# Altium schematic sheet Power_SchematicWITHFOOTPRINTS.SchDoc
size A4; SheetNumber: 1; SheetTotal: 1
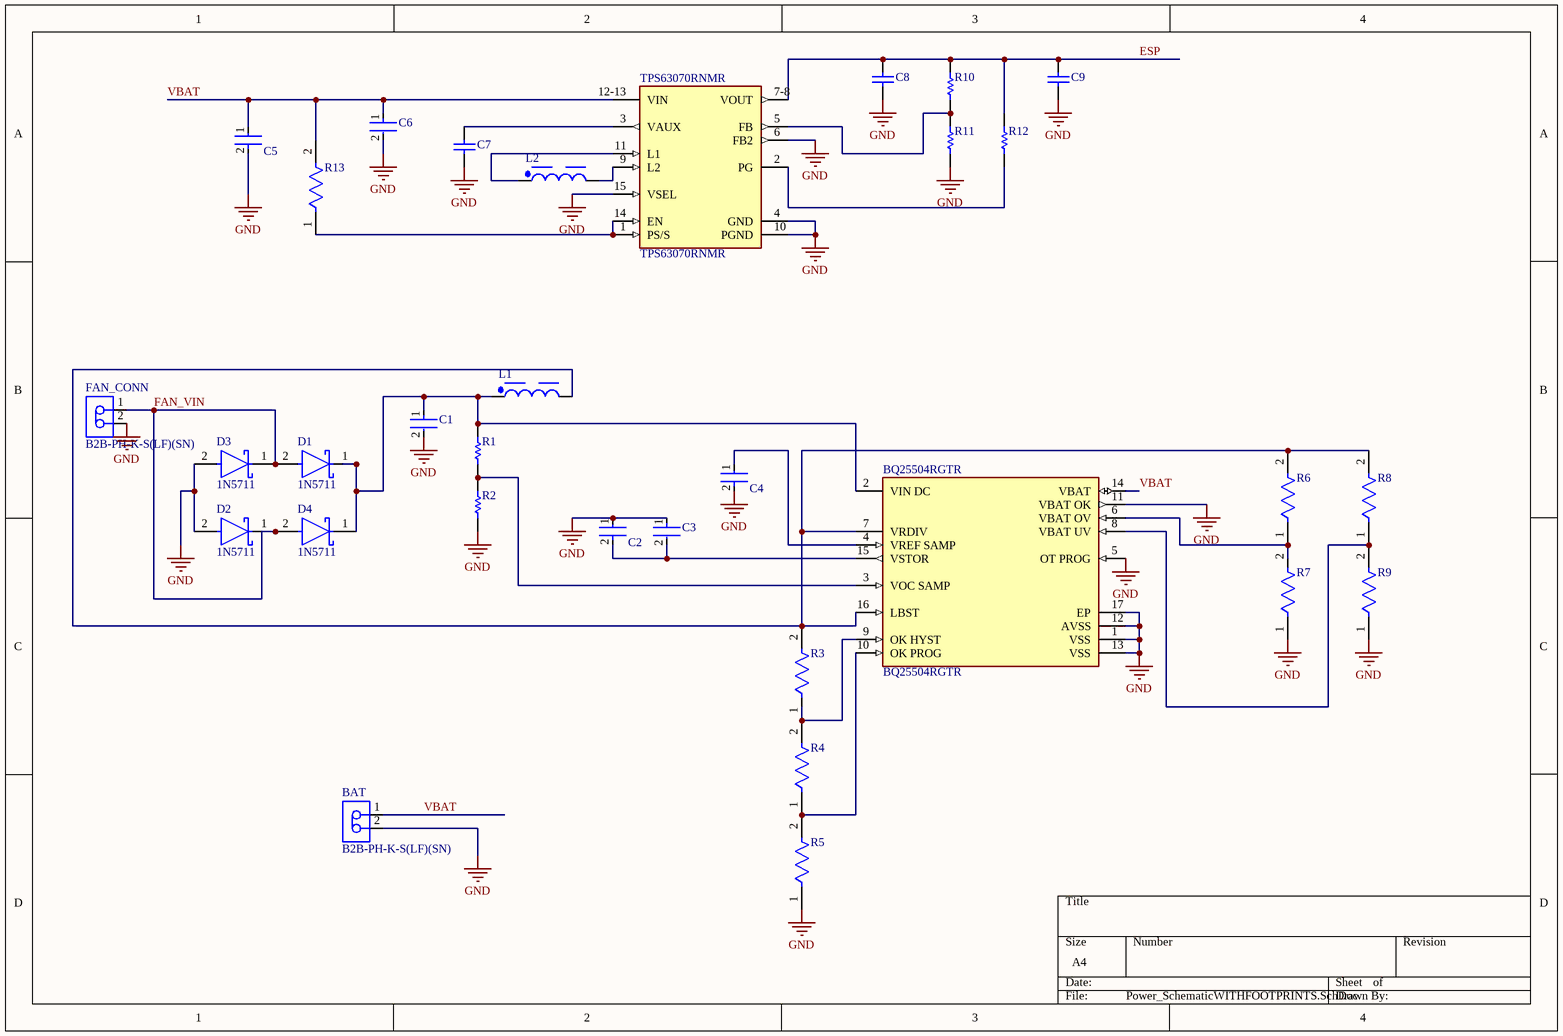
[diagram p0: Power_SchematicWITHFOOTPRINTS.SchDoc]

## Parts
BAT  B2B-PH-K-S(LF)(SN)  [JST-B2B-PH-K-S_V]
BQ25504RGTR  BQ25504RGTR  [FP-RGT0016C-IPC_B]
C1  RCER71E475K2DBH03A  [FP-RCE2A2-MFG]  (value not drawn)
C2  562R5GAS10  [FP-562R5GAS10-MFG]  (value not drawn)
C3  RCER71E475K2DBH03A  [FP-RCE2A2-MFG]  (value not drawn)
C4  562R5GAS10  [FP-562R5GAS10-MFG]  (value not drawn)
C5  562R5GAS10  [FP-562R5GAS10-MFG]  (value not drawn)
C6  RCER71E106K3DBH03A  [FP-RCE3DB-MFG]  (value not drawn)
C7  C320C104K5R5TA  [CAPR51-254-508X318X736]  (value not drawn)
C8  C320C104K5R5TA  [CAPR51-254-508X318X736]  (value not drawn)
C9  C320C104K5R5TA  [CAPR51-254-508X318X736]  (value not drawn)
D1  1N5711  [FP-DO-35-MFG]
D2  1N5711  [FP-DO-35-MFG]
D3  1N5711  [FP-DO-35-MFG]
D4  1N5711  [FP-DO-35-MFG]
FAN_CONN  B2B-PH-K-S(LF)(SN)  [JST-B2B-PH-K-S_V]
L1  7447471033  [WE-TIS_1111]  (value not drawn)
L2  744741221  [WE-TI_8055]  (value not drawn)
R1  PR02000206202JA100  [VISH-A1-2_V2]  (value not drawn)
R2  PR02000206202JA100  [VISH-A1-2_V2]  (value not drawn)
R3  MRS25000C1000FRP00  [FP-MRS25-MFG]  (value not drawn)
R4  MRS25000C1000FRP00  [FP-MRS25-MFG]  (value not drawn)
R5  MRS25000C1000FRP00  [FP-MRS25-MFG]  (value not drawn)
R6  MRS25000C1000FRP00  [FP-MRS25-MFG]  (value not drawn)
R7  MRS25000C1000FRP00  [FP-MRS25-MFG]  (value not drawn)
R8  MRS25000C1000FRP00  [FP-MRS25-MFG]  (value not drawn)
R9  MRS25000C1000FRP00  [FP-MRS25-MFG]  (value not drawn)
R10  PR02000206202JA100  [VISH-A1-2_V2]  (value not drawn)
R11  PR02000206202JA100  [VISH-A1-2_V2]  (value not drawn)
R12  PR02000206202JA100  [VISH-A1-2_V2]  (value not drawn)
R13  MRS25000C1002FCT00  [FP-MRS25-MFG]  (value not drawn)
TPS63070RNMR  TPS63070RNMR  [FP-RNM0015A-MFG]

## Nets
GND: BAT.2 BQ25504RGTR.1(VSS) BQ25504RGTR.5(OT_PROG) BQ25504RGTR.11(VBAT_OK) BQ25504RGTR.12(AVSS) BQ25504RGTR.13(VSS) BQ25504RGTR.17(EP) C1.2 C2.1 C3.1 C4.2 C5.2 C6.2 C7.1 C8.1 C9.1 D2.2(A) D3.2(A) FAN_CONN.2 R2.1 R5.1 R7.1 R9.1 R11.1 TPS63070RNMR.4(GND) TPS63070RNMR.6(FB2) TPS63070RNMR.10(PGND) TPS63070RNMR.15(VSEL)
ESP: C8.2 C9.2 R10.2 R12.2 TPS63070RNMR.7-8(VOUT)
FAN_VIN: D1.2(A) D2.1(C) D3.1(C) D4.2(A) FAN_CONN.1
VBAT: BAT.1 BQ25504RGTR.14(VBAT) C5.1 C6.1 R13.2 TPS63070RNMR.12-13(VIN)
NetBQ25504RGTR_2: BQ25504RGTR.2(VIN_DC) C1.1 D1.1(C) D4.1(C) L1.1 R1.2
NetBQ25504RGTR_3: BQ25504RGTR.3(VOC_SAMP) R1.1 R2.2
NetBQ25504RGTR_4: BQ25504RGTR.4(VREF_SAMP) C4.1
NetBQ25504RGTR_6: BQ25504RGTR.6(VBAT_OV) R6.1 R7.2
NetBQ25504RGTR_7: BQ25504RGTR.7(VRDIV) BQ25504RGTR.16(LBST) L1.2 R3.2 R6.2 R8.2
NetBQ25504RGTR_8: BQ25504RGTR.8(VBAT_UV) R8.1 R9.2
NetBQ25504RGTR_9: BQ25504RGTR.9(OK_HYST) R3.1 R4.2
NetBQ25504RGTR_10: BQ25504RGTR.10(OK_PROG) R4.1 R5.2
NetBQ25504RGTR_15: BQ25504RGTR.15(VSTOR) C2.2 C3.2
NetC7_2: C7.2 TPS63070RNMR.3(VAUX)
NetL2_1: L2.1 TPS63070RNMR.11(L1)
NetL2_2: L2.2 TPS63070RNMR.9(L2)
NetR10_1: R10.1 R11.2 TPS63070RNMR.5(FB)
NetR12_1: R12.1 TPS63070RNMR.2(PG)
NetR13_1: R13.1 TPS63070RNMR.1(PS/S) TPS63070RNMR.14(EN)

## Library data of the parts
BAT FAN_CONN = CMP-2000-05162-1: Male Header, Pitch 2 mm, 1 x 2 Position, Height 6 mm, Tail Length 3.4 mm, -25 to 85 degC, RoHS, Bulk; Manufacturer: JST; Pitch: 2mm; Style/Orientation: StraightHeader/Plug; No of Positions: 2; Datasheet Version: Nov-08; Datasheet URL: http://datasheet.octopart.com/B2B-PH-K-S%28LF%29%28SN%29-JST-datasheet-8324864.pdf; Manufacturer URL: http://www.jst.com/home2.html; Type: ShroudedHeader; Termination: Crimp
BQ25504RGTR = CMP-0321-00248-3: IC ENERGY HARV CTRLR BATT 16QFN; Operating Supply Current: 330nA; Switching Frequency: 1MHz; Max Supply Voltage: 5.25V; Min Supply Voltage: 2.5V; Min Input Voltage: 130mV; Operating Supply Voltage: 3V; Output Current: 200mA; Min Operating Temperature: -40°C; Package Quantity: 3000; REACH SVHC: No SVHC; Case/Package: QFN; Height: 0.9mm; RoHS Compliant: Yes; Max Operating Temperature: 85°C; Number of Pins: 16; Series: BQ25504; Contact Plating: Gold; Lead Free: Lead Free; Packaging: Tape and Reel; Length: 3mm; Radiation Hardening: No
C1 C3 = CMP-06035-022497-1: Cap Ceramic 4.7uF 25V X7R ±10% Radial 2.5mm +125°C Automotive Ammo Pack; Lead/Base Style: Straight; Lead Diameter: 0.5mm; Height - Seated (Max): 0.157inch; Voltage Rating (DC): 25V; Height: 4mm; Length: 0.217inch; Max Operating Temperature: 125°C; Ratings: AEC-Q200; Dielectric: X7R; Resistor Type: Ceramic; Packaging: Tape and Reel; Tolerance: 10%; Termination: Radial; Min Operating Temperature: -55°C; Case/Package: Radial; Width: 0.124inch; Lead Pitch: 0.098inch; Package Quantity: 2000; Voltage Rating: 25V; Mount: Through Hole; Capacitance: 4.7uF
C2 C4 C5 = CMP-02417-000061-1: CAP CER 10000PF 1KV Z5U RADIAL; Dissipation Factor: 2.5%; Tolerance: 20%; Lead Length: 29mm; Lead Diameter: 0.64mm; Lead/Base Style: Straight; Application(s): GENERAL PURPOSE; Capacitance: 10nF; Voltage Rating: 1kV; Voltage Rating (DC): 1kV; Depth: 4mm; Package Quantity: 250; Case/Package: Radial; Radiation Hardening: No; Diameter: 12.4mm; Dielectric: Z5U; Series: Cera-Mite 562R; Height: 0.25inch; Length: 2inch; Resistor Type: Ceramic; Width: 4mm; Contact Plating: Tin; Height - Seated (Max): 0.613inch; Packaging: Bulk; Lead Free: Lead Free; Construction: RADIAL; Mount: Through Hole; RoHS Compliant: Yes; Termination: Radial; Min Operating Temperature: -55°C; Lead Pitch: 9.5mm; Weight: 0.01lb; Max Operating Temperature: 105°C; Voltage: 1kV
C6 = CMP-06035-005830-1: Cap Ceramic 10uF 25V X7R ±10% Radial 2.5mm +125°C Automotive Ammo Pack; Lead/Base Style: Straight; Lead Diameter: 0.5mm; Case/Package: Radial; Voltage Rating (DC): 25V; Tolerance: 10%; Lead Pitch: 0.098inch; Termination: Radial; Height - Seated (Max): 0.197inch; Resistor Type: Ceramic; Min Operating Temperature: -55°C; Dielectric: X7R; Length: 0.217inch; Voltage Rating: 25V; Width: 0.157inch; Height: 5mm; Packaging: Tape and Reel; Ratings: AEC-Q200; Max Operating Temperature: 125°C; Package Quantity: 1500; Mount: Through Hole; Capacitance: 10uF
C7-C9 = CMP-1664-00004-1: Radial Leaded Multilayer Ceramic Capacitor, 0.1 uF, +/- 10%, 50 V, -55 to 125 degC, 2-Pin THD, RoHS, Tape and Reel; Case\Package: SOT-23-5; Max Power Dissipation: 250 mW; Output Current: 150 mA; Dropout Voltage: 260 mV; Outputs: 1; Output Voltage: 5 V; Max Input Voltage: 8 V; Min Operating Temperature: -40 degC; Packaging: Tape and Reel; Height: 1.3 mm; Radiation Hardening: No; Pins: 5; ComponentLink1Description: Manufacturer URL; Mount: Surface Mount; RoHSCompliant: true; Max Operating Temperature: 85 degC; PackageReference: CAPR51-254-508X318X736; ComponentLink2URL: http://www.kemet.com/docfinder?Partnumber=C320C104K5R5TA; PackageDescription: 2-Pin Through Hole Device, Body 5.08 x 3.18 mm, Pitch 2.54 mm; ComponentLink1URL: http://www.kemet.com/; Width: 1.8 mm; Package Quantity: 3000; DatasheetVersion: Dec-15; Length: 3 mm; ComponentLink2Description: Datasheet
D1-D4 = CMP-2000-05519-2: RF DIODE SCHOTTKY 70V 430MW DO35; Manufacturer: STMicroelectronics; Capacitance: 2pF; Max Junction Temp: +200°C; Value: 2pF; Forward Current: 15mA; Description: RF Diode Schottky - Single 70V 15mA 430mW DO-35; ComponentLink2URL: https://www.st.com/resource/en/datasheet/1n5711.pdf; Reverse Voltage: 70V; Max Repetitive Reverse Voltage: 70V; Temperature Range Low: -65°C; Manufacturer Part Number: 1N5711; ComponentLink2Description: Datasheet; Automotive: No; Device Class L3: Schottky Diodes; Temperature Range High: +200°C; Ipc Land Pattern Name: DIOPA762W75L450D200; Octopart: https://octopart.com/1n5711-stmicroelectronics-55399277; Category: Diode; Height: 2mm; RoHS: TRUE; Package: DO-35; Lead Free: Yes; Digikey Description: RF DIODE SCHOTTKY 70V 430MW DO35; Mouser Description: Schottky Diodes & Rectifiers 15mA 70 Volt; Device Class L1: Discrete Semiconductors; Temperature: -65°C to +200°C; Device Class L2: Diodes
L1 = CMP-1406-00025-2: NexarPartId: 22866550; Series Resistance: 9mΩ; Inductance Tolerance: 20%; Shielding: Shielded; Inductance: 3.3µH; Current Rating: 7.5A; Frequency: 58MHz; Lead Diameter: 650µm; Saturation Current: 8A; Test Frequency: 1kHz; Core Material: Ferrite; Min Operating Temperature: -40°C; Max Operating Temperature: 125°C; Length: 11mm; Height: 11.5mm; Case/Package: Radial; Termination: Radial; Mount: Radial, Through Hole; RoHS: Compliant; Max DC Current: 7.5A; REACH SVHC: Unknown; Ambient Temperature Range High: 85°C; DC Resistance (DCR): 9mΩ; Self Resonant Frequency: 58MHz; RMS Current (Irms): 7.5A; Features: Shielded; Diameter: 11mm; Tolerance: 20%; Ambient Temperature Range Low: -40°C; Composition: Wirewound; Number of Pins: 2; Width: 11mm; Lead Pitch: 5mm
L2 = CMP-0225-00032-3: NexarPartId: 22803387; Inductance Tolerance: 10%; Self Resonant Frequency: 5MHz; Inductance: 220µH; DC Resistance (DCR): 970mΩ; Current Rating: 660mA; Max Operating Temperature: 125°C; Min Operating Temperature: -40°C; RoHS: Compliant; Number of Pins: 2; Ambient Temperature Range High: 85°C; Length: 8.5mm; Height: 5.5mm; Ambient Temperature Range Low: -40°C; Width: 8.5mm
R1 R2 R10-R12 = CMP-1240-00001-1: Power Metal Film Leaded Resistor, 62 KOhm +/-5%, 2 W, 2-Pin THD, RoHS, Ammo Pack; Manufacturer: Vishay Semiconductor; Resistance: 62 KOhm; Temperature Coefficient: +/-250 ppm/degC; Power: 2 W; ComponentLink2URL: http://www.vishay.com/docs/28729/28729.pdf; Mounting Technology: Through Hole; Tolerance: +/-5%; ComponentLink3Description: Package Specification; ComponentLink3URL: http://www.vishay.com/docs/28729/28729.pdf; ComponentLink1Description: Manufacturer URL; PartNumber: PR02000206202JA100; ComponentLink2Description: Datasheet; DatasheetVersion: Jun-13; PackageDescription: 2-Pin Axial Lead, Body 10 x 3.9 mm; ComponentLink1URL: http://www.vishay.com/; Packing: Ammo Pack; RoHS: TRUE
R3-R9 = CMP-00030-42757237-1: MRS25000C1000FRP00 Resistor, 100 Ohm, ± 1%, 600 mW, Axial Leaded, Metal Film (Thin Film), Professional; Max Power Dissipation: 600mW; Resistance: 100Ω; Voltage Rating: 350V; Temperature Coefficient: 50ppm/°C; Lead Diameter: 600µm; RoHS: Compliant; Radiation Hardening: No; Schedule B: 8533210090, 8533210090; Length: 6.5mm; Packaging: Tape & Reel (TR); Number of Terminations: 2; Mount: Through Hole; Width: 2.5mm; Tolerance: 1%; Military Standard: Not; Voltage Rating (DC): 350V; Contact Plating: Tin; Number of Pins: 2; Max Operating Temperature: 155°C; NexarPartId: 42757237; Diameter: 2.5mm; Composition: Metal Film, Thin Film; REACH SVHC: Unknown; Power Rating: 600mW; Lead Free: Lead Free; Termination: Axial; Case/Package: Axial; Min Operating Temperature: -55°C
R13 = CMP-00030-42632392-1: MRS25000C1002FCT00 Resistor, 10 kOhm, ± 1%, 600 mW, Axial Leaded, Metal Film (Thin Film), Professional; Power Rating: 600mW; Voltage Rating (DC): 350V; Lead Length: 26mm; Resistance: 10kΩ; Temperature Coefficient: 50ppm/°C; Termination: Axial; Number of Terminations: 2; Diameter: 2.5mm; Composition: Metal Film, Thin Film; Number of Pins: 2; Length: 6.5mm; Military Standard: Not; RoHS: Compliant; NexarPartId: 42632392; Width: 2.5mm; Radiation Hardening: No; Voltage Rating: 350V; Max Power Dissipation: 600mW; Min Operating Temperature: -55°C; Lead Free: Lead Free; Max Operating Temperature: 155°C; Tolerance: 1%; Schedule B: 8533210090, 8533210090; Contact Plating: Tin; Mount: Through Hole; REACH SVHC: Unknown; Case/Package: Conformal
TPS63070RNMR = CMP-04918-000409-1: IC REG BCK BST ADJ 3.6A 15VQFN; Synchronous Rectifier: Yes; Output Type: Adjustable; Output Current: 2A; Max Input Voltage: 16V; Switching Frequency: 2.4MHz; Min Output Voltage: 2.5V; Output Configuration: Positive; Min Input Voltage: 2V; Topology: Buck-Boost; Number of Outputs: 1; Max Output Voltage: 9V; Quiescent Current: 50uA; Max Operating Temperature: 125°C; Case/Package: VQFN; Number of Pins: 15; RoHS Compliant: Yes; Mount: Surface Mount; Min Operating Temperature: -40°C; Lead Free: Lead Free; Packaging: Tape and Reel